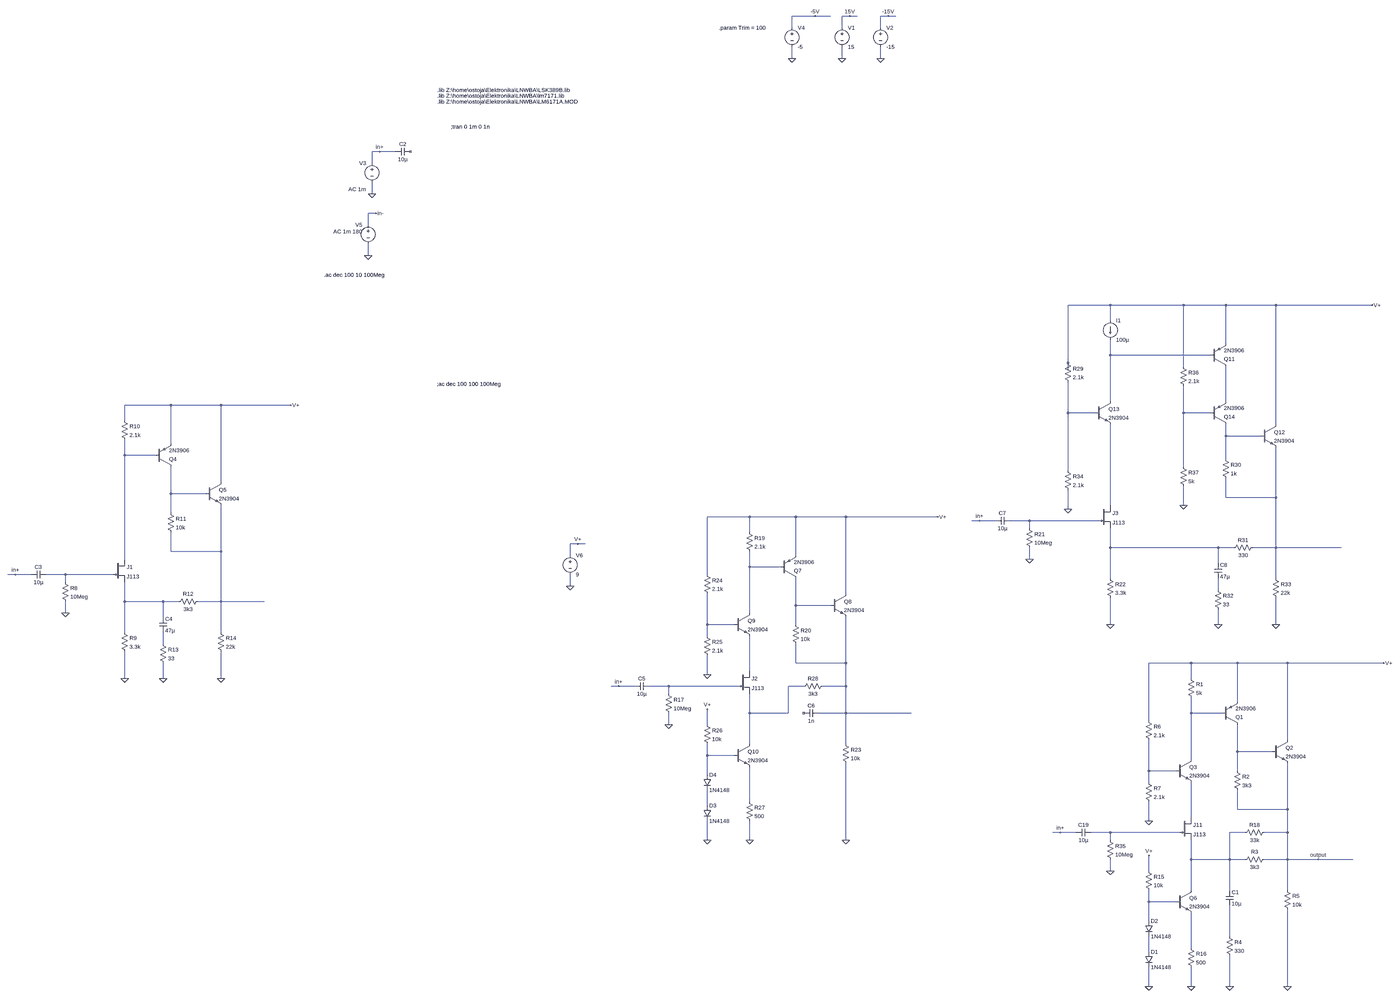
[diagram p0: schematic Figure_3.31.asc, whole sheet]
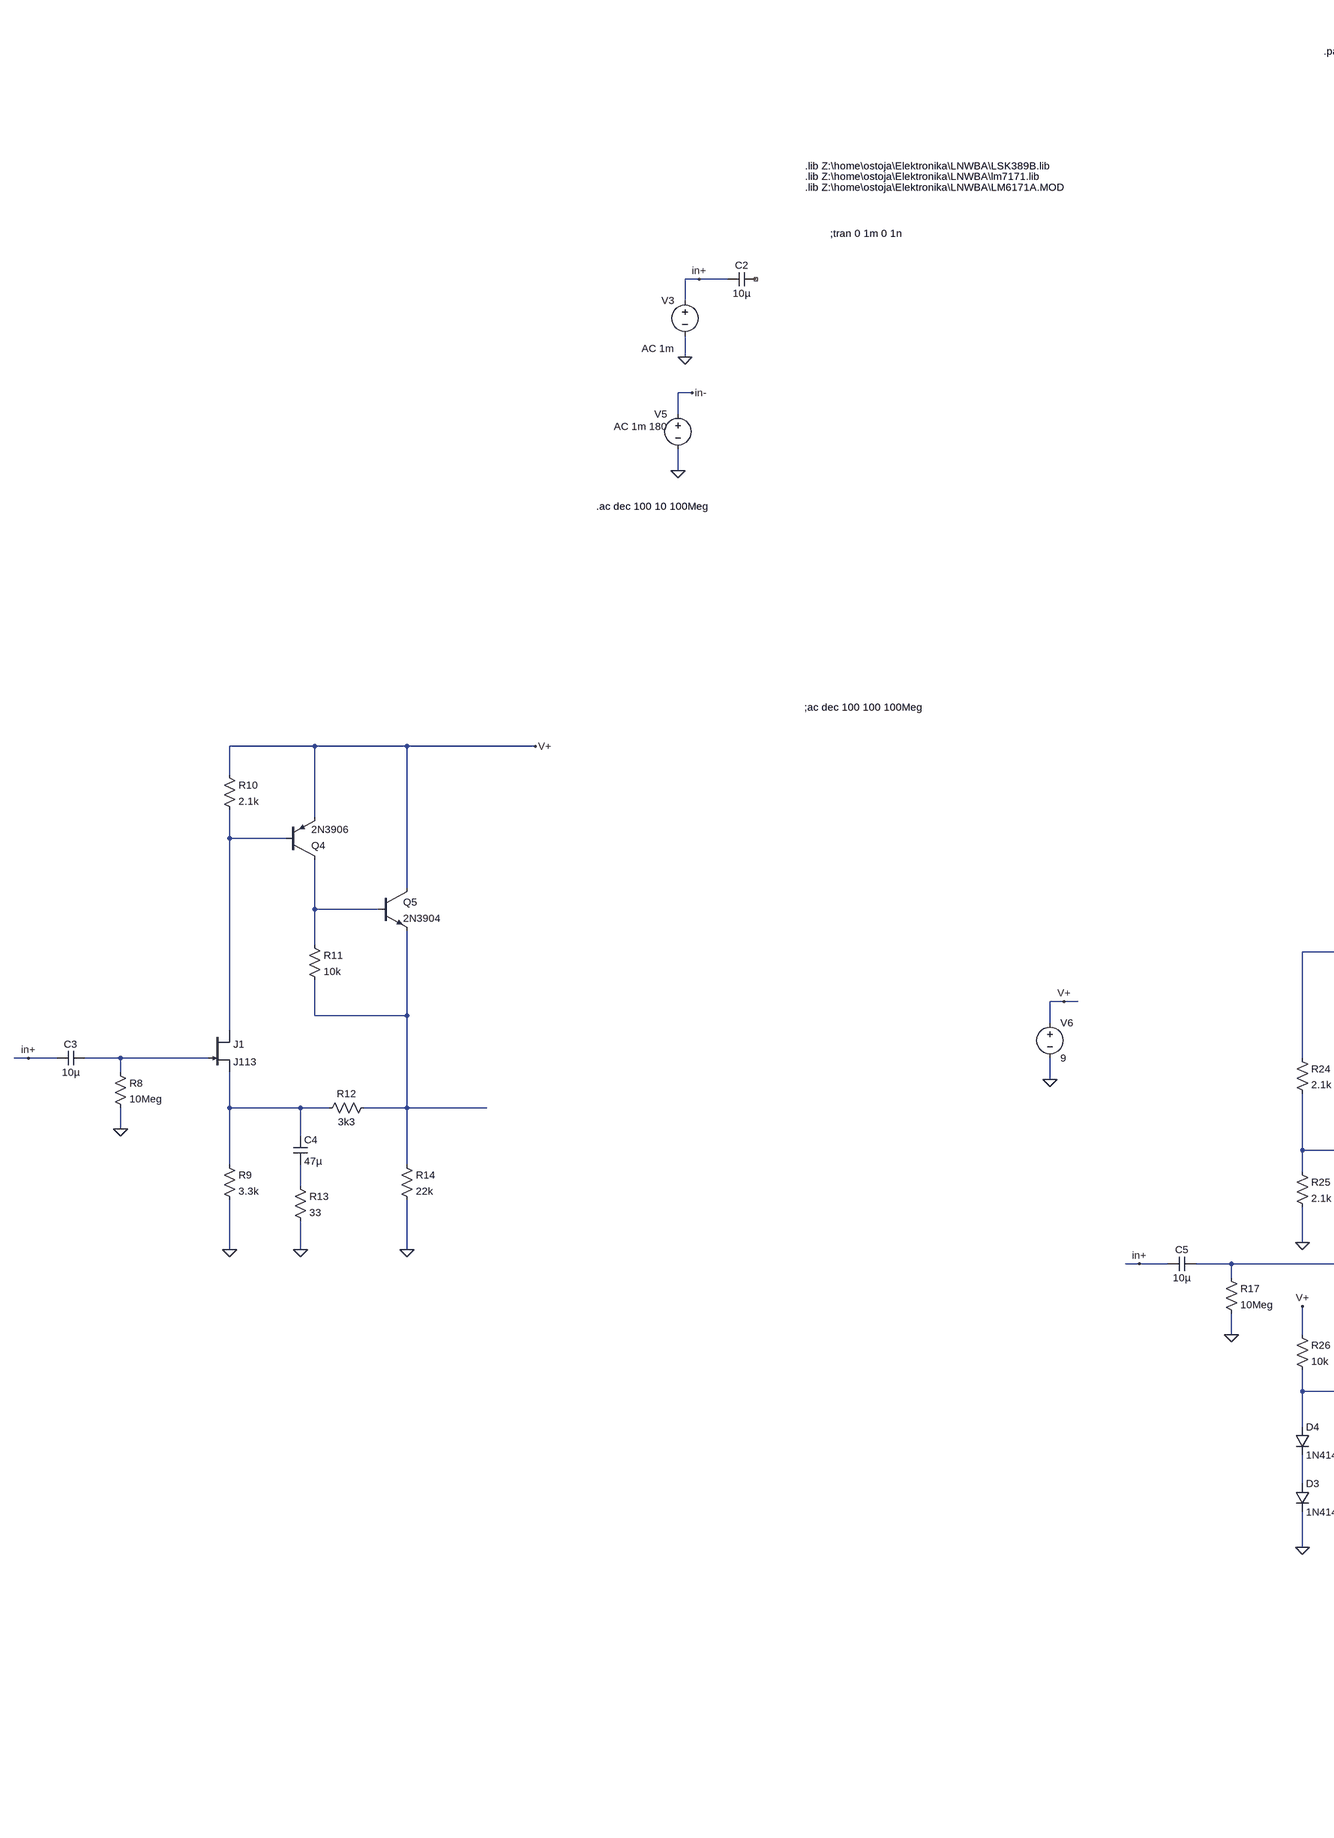
[diagram p1: schematic Figure_3.31.asc, part, row 1 of 1, column 1 of 2]
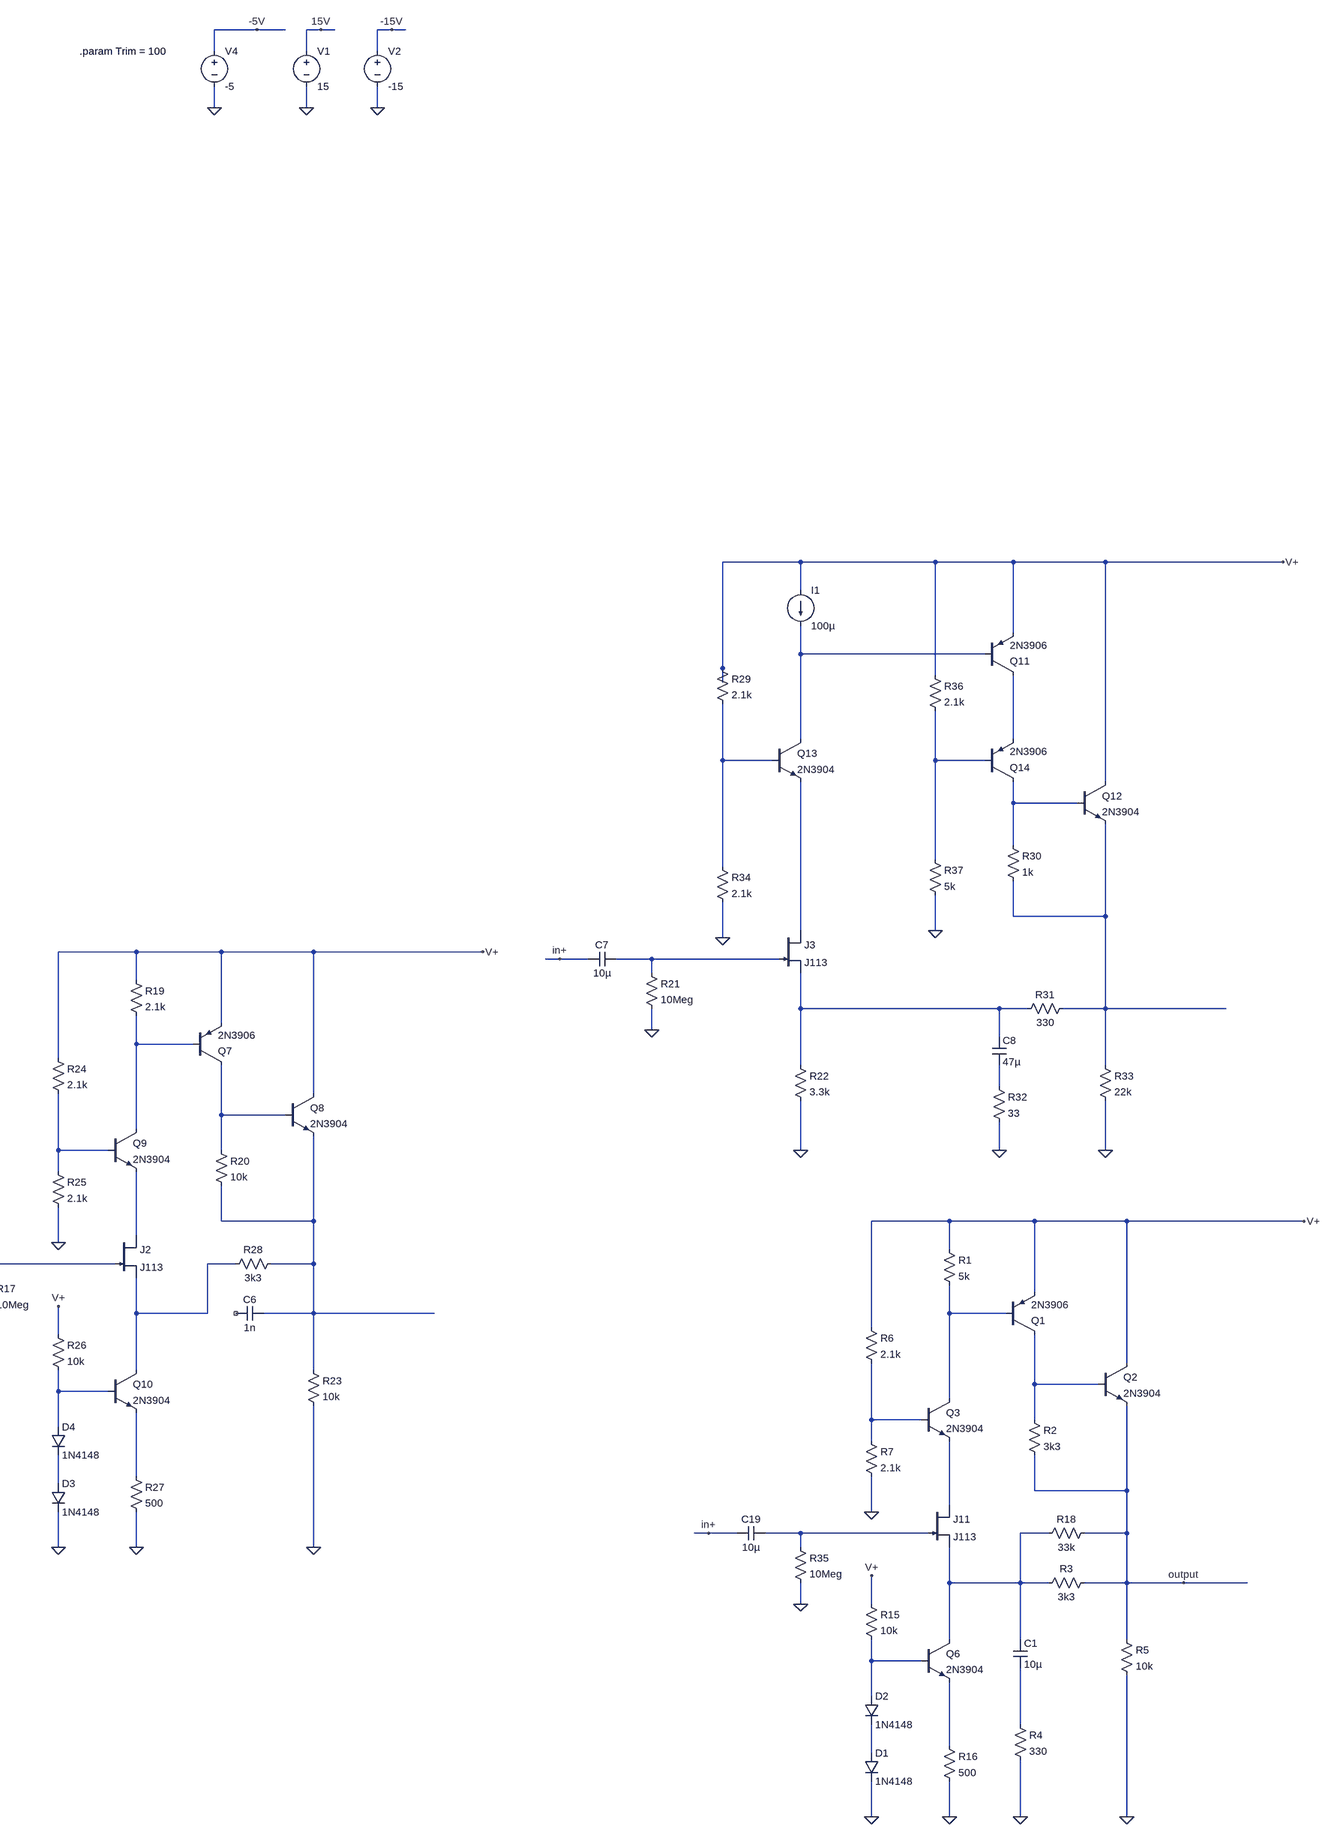
[diagram p2: schematic Figure_3.31.asc, part, row 1 of 1, column 2 of 2]
Figure_3.31.asc, the LTspice schematic file:
Version 4
SHEET 1 8100 6004
WIRE 960 -592 864 -592
WIRE 1024 -592 960 -592
WIRE 1104 -592 1072 -592
WIRE 1136 -592 1104 -592
WIRE 1264 -592 1232 -592
WIRE 1296 -592 1264 -592
WIRE 864 -544 864 -592
WIRE 1072 -544 1072 -592
WIRE 1232 -544 1232 -592
WIRE 864 -416 864 -464
WIRE 1072 -416 1072 -464
WIRE 1232 -416 1232 -464
WIRE -2000 32 -2032 32
WIRE -1936 32 -2000 32
WIRE -2032 80 -2032 32
WIRE -2032 208 -2032 160
WIRE -2016 288 -2048 288
WIRE -2048 336 -2048 288
WIRE -2048 464 -2048 416
WIRE 4720 912 4544 912
WIRE 5024 912 4720 912
WIRE 5200 912 5024 912
WIRE 5408 912 5200 912
WIRE 5808 912 5408 912
WIRE 4720 976 4720 912
WIRE 5200 1072 5200 912
WIRE 4720 1120 4720 1056
WIRE 5136 1120 4720 1120
WIRE 4544 1152 4544 912
WIRE 5024 1168 5024 912
WIRE 4544 1184 4544 1152
WIRE 4720 1312 4720 1120
WIRE 5200 1312 5200 1168
WIRE -3568 1328 -3760 1328
WIRE -3360 1328 -3568 1328
WIRE -2960 1328 -3360 1328
WIRE 4544 1360 4544 1232
WIRE 4656 1360 4544 1360
WIRE 5024 1360 5024 1248
WIRE 5136 1360 5024 1360
WIRE -3760 1392 -3760 1328
WIRE 5408 1408 5408 912
WIRE 5200 1456 5200 1408
WIRE 5344 1456 5200 1456
WIRE -3568 1488 -3568 1328
WIRE -3760 1536 -3760 1472
WIRE -3632 1536 -3760 1536
WIRE 5200 1552 5200 1456
WIRE 5024 1584 5024 1360
WIRE 4544 1600 4544 1360
WIRE -3360 1648 -3360 1328
WIRE -3568 1696 -3568 1584
WIRE -3424 1696 -3568 1696
WIRE 5200 1712 5200 1632
WIRE 5408 1712 5408 1504
WIRE 5408 1712 5200 1712
WIRE 4720 1744 4720 1408
WIRE 5024 1744 5024 1664
WIRE 4544 1760 4544 1680
WIRE -3568 1776 -3568 1696
WIRE 688 1792 512 1792
WIRE 880 1792 688 1792
WIRE 1088 1792 880 1792
WIRE 1488 1792 1088 1792
WIRE 4176 1808 4144 1808
WIRE 4240 1808 4176 1808
WIRE 4384 1808 4304 1808
WIRE 4672 1808 4384 1808
WIRE 4384 1840 4384 1808
WIRE 688 1856 688 1792
WIRE -608 1904 -640 1904
WIRE -576 1904 -608 1904
WIRE 4720 1920 4720 1840
WIRE 5168 1920 4720 1920
WIRE 5232 1920 5168 1920
WIRE 5408 1920 5408 1712
WIRE 5408 1920 5312 1920
WIRE 5680 1920 5408 1920
WIRE -3568 1936 -3568 1856
WIRE -3360 1936 -3360 1744
WIRE -3360 1936 -3568 1936
WIRE -640 1952 -640 1904
WIRE 880 1952 880 1792
WIRE -3760 1968 -3760 1536
WIRE 4384 1968 4384 1920
WIRE 5168 1984 5168 1920
WIRE 688 2000 688 1936
WIRE 816 2000 688 2000
WIRE -4304 2032 -4336 2032
WIRE -4240 2032 -4304 2032
WIRE -4096 2032 -4176 2032
WIRE -3808 2032 -4096 2032
WIRE 512 2032 512 1792
WIRE 4720 2048 4720 1920
WIRE 5408 2048 5408 1920
WIRE -4096 2064 -4096 2032
WIRE -640 2080 -640 2032
WIRE 5168 2096 5168 2048
WIRE 1088 2112 1088 1792
WIRE -3760 2144 -3760 2064
WIRE -3600 2144 -3760 2144
WIRE -3536 2144 -3600 2144
WIRE -3360 2144 -3360 1936
WIRE -3360 2144 -3456 2144
WIRE -3088 2144 -3360 2144
WIRE 880 2160 880 2048
WIRE 1024 2160 880 2160
WIRE -4096 2192 -4096 2144
WIRE 688 2192 688 2000
WIRE -3600 2208 -3600 2144
WIRE 512 2240 512 2112
WIRE 624 2240 512 2240
WIRE 880 2240 880 2160
WIRE 4720 2240 4720 2128
WIRE 5168 2240 5168 2176
WIRE 5408 2240 5408 2128
WIRE -3760 2272 -3760 2144
WIRE -3360 2272 -3360 2144
WIRE 512 2288 512 2240
WIRE -3600 2320 -3600 2272
WIRE 880 2400 880 2320
WIRE 1088 2400 1088 2208
WIRE 1088 2400 880 2400
WIRE 5056 2400 4880 2400
WIRE 5248 2400 5056 2400
WIRE 5456 2400 5248 2400
WIRE 5856 2400 5456 2400
WIRE 688 2432 688 2288
WIRE 512 2448 512 2368
WIRE -3760 2464 -3760 2352
WIRE -3600 2464 -3600 2400
WIRE -3360 2464 -3360 2352
WIRE 5056 2464 5056 2400
WIRE 144 2496 112 2496
WIRE 208 2496 144 2496
WIRE 352 2496 272 2496
WIRE 640 2496 352 2496
WIRE 912 2496 848 2496
WIRE 1088 2496 1088 2400
WIRE 1088 2496 992 2496
WIRE 352 2528 352 2496
WIRE 5248 2560 5248 2400
WIRE 688 2608 688 2528
WIRE 848 2608 848 2496
WIRE 848 2608 688 2608
WIRE 1088 2608 1088 2496
WIRE 1088 2608 976 2608
WIRE 1360 2608 1088 2608
WIRE 5056 2608 5056 2544
WIRE 5184 2608 5056 2608
WIRE 4880 2640 4880 2400
WIRE 352 2656 352 2608
WIRE 512 2656 512 2592
WIRE 5456 2720 5456 2400
WIRE 688 2736 688 2608
WIRE 1088 2736 1088 2608
WIRE 5248 2768 5248 2656
WIRE 5392 2768 5248 2768
WIRE 512 2784 512 2736
WIRE 624 2784 512 2784
WIRE 5056 2800 5056 2608
WIRE 4880 2848 4880 2720
WIRE 4992 2848 4880 2848
WIRE 5248 2848 5248 2768
WIRE 512 2864 512 2784
WIRE 4880 2896 4880 2848
WIRE 688 2976 688 2832
WIRE 512 2992 512 2928
WIRE 5248 3008 5248 2928
WIRE 5456 3008 5456 2816
WIRE 5456 3008 5248 3008
WIRE 5056 3040 5056 2896
WIRE 4880 3056 4880 2976
WIRE 4512 3104 4480 3104
WIRE 4576 3104 4512 3104
WIRE 4720 3104 4640 3104
WIRE 5008 3104 4720 3104
WIRE 5280 3104 5216 3104
WIRE 5456 3104 5456 3008
WIRE 5456 3104 5360 3104
WIRE 512 3136 512 3056
WIRE 688 3136 688 3056
WIRE 1088 3136 1088 2816
WIRE 4720 3136 4720 3104
WIRE 5056 3216 5056 3136
WIRE 5216 3216 5216 3104
WIRE 5216 3216 5056 3216
WIRE 5280 3216 5216 3216
WIRE 5456 3216 5456 3104
WIRE 5456 3216 5360 3216
WIRE 5584 3216 5456 3216
WIRE 5728 3216 5584 3216
WIRE 4720 3264 4720 3216
WIRE 4880 3264 4880 3200
WIRE 5056 3344 5056 3216
WIRE 5216 3344 5216 3216
WIRE 5456 3344 5456 3216
WIRE 4880 3392 4880 3344
WIRE 4992 3392 4880 3392
WIRE 4880 3472 4880 3392
WIRE 5216 3536 5216 3408
WIRE 5056 3584 5056 3440
WIRE 4880 3600 4880 3536
WIRE 4880 3744 4880 3664
WIRE 5056 3744 5056 3664
WIRE 5216 3744 5216 3616
WIRE 5456 3744 5456 3424
FLAG 1104 -592 15V
FLAG 1264 -592 -15V
FLAG 1232 -416 0
FLAG 1072 -416 0
FLAG 960 -592 -5V
FLAG 864 -416 0
FLAG 4512 3104 in+
FLAG 5856 2400 V+
FLAG 4720 3264 0
FLAG 5056 3744 0
FLAG 5216 3744 0
FLAG 5456 3744 0
FLAG -2032 208 0
FLAG -2000 32 in+
FLAG -2048 464 0
FLAG -2016 288 in-
FLAG -608 1904 V+
FLAG -640 2080 0
FLAG 4880 3056 0
FLAG 5584 3216 output
FLAG -4304 2032 in+
FLAG -2960 1328 V+
FLAG -4096 2192 0
FLAG -3760 2464 0
FLAG -3600 2464 0
FLAG -3360 2464 0
FLAG 4880 3744 0
FLAG 4880 3200 V+
FLAG 144 2496 in+
FLAG 1488 1792 V+
FLAG 352 2656 0
FLAG 688 3136 0
FLAG 1088 3136 0
FLAG 512 2448 0
FLAG 512 3136 0
FLAG 512 2592 V+
FLAG 4176 1808 in+
FLAG 5808 912 V+
FLAG 4384 1968 0
FLAG 4720 2240 0
FLAG 5168 2240 0
FLAG 5408 2240 0
FLAG 4544 1760 0
FLAG 5024 1744 0
SYMBOL voltage 1072 -560 R0
WINDOW 123 0 0 Left 0
WINDOW 39 0 0 Left 0
SYMATTR InstName V1
SYMATTR Value 15
SYMBOL voltage 1232 -560 R0
WINDOW 123 0 0 Left 0
WINDOW 39 0 0 Left 0
SYMATTR InstName V2
SYMATTR Value -15
SYMBOL voltage 864 -560 R0
WINDOW 123 0 0 Left 0
WINDOW 39 0 0 Left 0
SYMATTR InstName V4
SYMATTR Value -5
SYMBOL njf 5008 3040 R0
SYMATTR InstName J11
SYMATTR Value J113
SYMBOL cap 4640 3088 R90
WINDOW 0 0 32 VBottom 2
WINDOW 3 32 32 VTop 2
SYMATTR InstName C19
SYMATTR Value 10µ
SYMBOL res 4704 3120 R0
SYMATTR InstName R35
SYMATTR Value 10Meg
SYMBOL pnp 5184 2656 M180
SYMATTR InstName Q1
SYMATTR Value 2N3906
SYMBOL res 5040 2448 R0
SYMATTR InstName R1
SYMATTR Value 5k
SYMBOL res 5232 2832 R0
SYMATTR InstName R2
SYMATTR Value 3k3
SYMBOL npn 5392 2720 R0
SYMATTR InstName Q2
SYMATTR Value 2N3904
SYMBOL res 5376 3200 R90
WINDOW 0 0 56 VBottom 2
WINDOW 3 32 56 VTop 2
SYMATTR InstName R3
SYMATTR Value 3k3
SYMBOL cap 5200 3408 M180
WINDOW 0 24 56 Left 2
WINDOW 3 24 8 Left 2
SYMATTR InstName C1
SYMATTR Value 10µ
SYMBOL res 5200 3520 R0
SYMATTR InstName R4
SYMATTR Value 330
SYMBOL res 5440 3328 R0
SYMATTR InstName R5
SYMATTR Value 10k
SYMBOL voltage -2032 64 M0
WINDOW 123 24 124 Left 2
WINDOW 39 0 0 Left 0
SYMATTR Value2 AC 1m
SYMATTR InstName V3
SYMATTR Value ""
SYMBOL cap -1872 16 R90
WINDOW 0 0 32 VBottom 2
WINDOW 3 32 32 VTop 2
SYMATTR InstName C2
SYMATTR Value 10µ
SYMBOL voltage -2048 320 M0
WINDOW 123 24 44 Left 2
WINDOW 39 0 0 Left 0
SYMATTR Value2 AC 1m 180
SYMATTR InstName V5
SYMATTR Value ""
SYMBOL voltage -640 1936 R0
WINDOW 123 0 0 Left 0
WINDOW 39 0 0 Left 0
SYMATTR InstName V6
SYMATTR Value 9
SYMBOL npn 4992 2800 R0
SYMATTR InstName Q3
SYMATTR Value 2N3904
SYMBOL res 4864 2624 R0
SYMATTR InstName R6
SYMATTR Value 2.1k
SYMBOL res 4864 2880 R0
SYMATTR InstName R7
SYMATTR Value 2.1k
SYMBOL njf -3808 1968 R0
SYMATTR InstName J1
SYMATTR Value J113
SYMBOL cap -4176 2016 R90
WINDOW 0 0 32 VBottom 2
WINDOW 3 32 32 VTop 2
SYMATTR InstName C3
SYMATTR Value 10µ
SYMBOL res -4112 2048 R0
SYMATTR InstName R8
SYMATTR Value 10Meg
SYMBOL res -3776 2256 R0
SYMATTR InstName R9
SYMATTR Value 3.3k
SYMBOL pnp -3632 1584 M180
SYMATTR InstName Q4
SYMATTR Value 2N3906
SYMBOL res -3776 1376 R0
SYMATTR InstName R10
SYMATTR Value 2.1k
SYMBOL res -3584 1760 R0
SYMATTR InstName R11
SYMATTR Value 10k
SYMBOL npn -3424 1648 R0
SYMATTR InstName Q5
SYMATTR Value 2N3904
SYMBOL res -3440 2128 R90
WINDOW 0 0 56 VBottom 2
WINDOW 3 32 56 VTop 2
SYMATTR InstName R12
SYMATTR Value 3k3
SYMBOL cap -3616 2272 M180
WINDOW 0 24 56 Left 2
WINDOW 3 24 8 Left 2
SYMATTR InstName C4
SYMATTR Value 47µ
SYMBOL res -3616 2304 R0
SYMATTR InstName R13
SYMATTR Value 33
SYMBOL res -3376 2256 R0
SYMATTR InstName R14
SYMATTR Value 22k
SYMBOL npn 4992 3344 R0
SYMATTR InstName Q6
SYMATTR Value 2N3904
SYMBOL diode 4864 3600 R0
SYMATTR InstName D1
SYMATTR Value 1N4148
SYMBOL diode 4864 3472 R0
SYMATTR InstName D2
SYMATTR Value 1N4148
SYMBOL res 4864 3248 R0
SYMATTR InstName R15
SYMATTR Value 10k
SYMBOL res 5040 3568 R0
SYMATTR InstName R16
SYMATTR Value 500
SYMBOL res 5376 3088 R90
WINDOW 0 0 56 VBottom 2
WINDOW 3 32 56 VTop 2
SYMATTR InstName R18
SYMATTR Value 33k
SYMBOL njf 640 2432 R0
SYMATTR InstName J2
SYMATTR Value J113
SYMBOL cap 272 2480 R90
WINDOW 0 0 32 VBottom 2
WINDOW 3 32 32 VTop 2
SYMATTR InstName C5
SYMATTR Value 10µ
SYMBOL res 336 2512 R0
SYMATTR InstName R17
SYMATTR Value 10Meg
SYMBOL pnp 816 2048 M180
SYMATTR InstName Q7
SYMATTR Value 2N3906
SYMBOL res 672 1840 R0
SYMATTR InstName R19
SYMATTR Value 2.1k
SYMBOL res 864 2224 R0
SYMATTR InstName R20
SYMATTR Value 10k
SYMBOL npn 1024 2112 R0
SYMATTR InstName Q8
SYMATTR Value 2N3904
SYMBOL res 1072 2720 R0
SYMATTR InstName R23
SYMATTR Value 10k
SYMBOL npn 624 2192 R0
SYMATTR InstName Q9
SYMATTR Value 2N3904
SYMBOL res 496 2016 R0
SYMATTR InstName R24
SYMATTR Value 2.1k
SYMBOL res 496 2272 R0
SYMATTR InstName R25
SYMATTR Value 2.1k
SYMBOL npn 624 2736 R0
SYMATTR InstName Q10
SYMATTR Value 2N3904
SYMBOL diode 496 2992 R0
SYMATTR InstName D3
SYMATTR Value 1N4148
SYMBOL diode 496 2864 R0
SYMATTR InstName D4
SYMATTR Value 1N4148
SYMBOL res 496 2640 R0
SYMATTR InstName R26
SYMATTR Value 10k
SYMBOL res 672 2960 R0
SYMATTR InstName R27
SYMATTR Value 500
SYMBOL res 1008 2480 R90
WINDOW 0 0 56 VBottom 2
WINDOW 3 32 56 VTop 2
SYMATTR InstName R28
SYMATTR Value 3k3
SYMBOL cap 976 2592 R90
WINDOW 0 0 32 VBottom 2
WINDOW 3 32 32 VTop 2
SYMATTR InstName C6
SYMATTR Value 1n
SYMBOL njf 4672 1744 R0
SYMATTR InstName J3
SYMATTR Value J113
SYMBOL cap 4304 1792 R90
WINDOW 0 0 32 VBottom 2
WINDOW 3 32 32 VTop 2
SYMATTR InstName C7
SYMATTR Value 10µ
SYMBOL res 4368 1824 R0
SYMATTR InstName R21
SYMATTR Value 10Meg
SYMBOL res 4704 2032 R0
SYMATTR InstName R22
SYMATTR Value 3.3k
SYMBOL pnp 5136 1168 M180
SYMATTR InstName Q11
SYMATTR Value 2N3906
SYMBOL res 5184 1536 R0
SYMATTR InstName R30
SYMATTR Value 1k
SYMBOL npn 5344 1408 R0
SYMATTR InstName Q12
SYMATTR Value 2N3904
SYMBOL res 5328 1904 R90
WINDOW 0 0 56 VBottom 2
WINDOW 3 32 56 VTop 2
SYMATTR InstName R31
SYMATTR Value 330
SYMBOL cap 5152 2048 M180
WINDOW 0 24 56 Left 2
WINDOW 3 24 8 Left 2
SYMATTR InstName C8
SYMATTR Value 47µ
SYMBOL res 5152 2080 R0
SYMATTR InstName R32
SYMATTR Value 33
SYMBOL res 5392 2032 R0
SYMATTR InstName R33
SYMATTR Value 22k
SYMBOL current 4720 976 R0
WINDOW 123 0 0 Left 0
WINDOW 39 0 0 Left 0
SYMATTR InstName I1
SYMATTR Value 100µ
SYMBOL npn 4656 1312 R0
SYMATTR InstName Q13
SYMATTR Value 2N3904
SYMBOL res 4528 1136 R0
SYMATTR InstName R29
SYMATTR Value 2.1k
SYMBOL res 4528 1584 R0
SYMATTR InstName R34
SYMATTR Value 2.1k
SYMBOL res 5008 1152 R0
SYMATTR InstName R36
SYMATTR Value 2.1k
SYMBOL res 5008 1568 R0
SYMATTR InstName R37
SYMATTR Value 5k
SYMBOL pnp 5136 1408 M180
SYMATTR InstName Q14
SYMATTR Value 2N3906
TEXT -1192 -224 Left 2 !.lib Z:\\home\\ostoja\\Elektronika\\LNWBA\\LSK389B.lib
TEXT -1136 -72 Left 2 !;tran 0 1m 0 1n
TEXT -1192 -200 Left 2 !.lib Z:\\home\\ostoja\\Elektronika\\LNWBA\\lm7171.lib
TEXT -1192 -176 Left 2 !.lib Z:\\home\\ostoja\\Elektronika\\LNWBA\\LM6171A.MOD
TEXT 560 -544 Left 2 !.param Trim = 100
TEXT -1194 1240 Left 2 !;ac dec 100 100 100Meg
TEXT -2232 544 Left 2 !.ac dec 100 10 100Meg

The netlist it stands for:
* Figure_3.31.asc
V1 15V 0 15
V2 -15V 0 -15
V4 -5V 0 -5
J11 N030 N031 N032 J113
C19 N031 in+ 10µ
R35 N031 0 10Meg
Q1 N025 N024 V+ 0 2N3906
R1 V+ N024 5k
R2 N025 output 3k3
Q2 V+ N025 output 0 2N3904
R3 output N032 3k3
C1 N034 N032 10µ
R4 N034 0 330
R5 output 0 10k
V3 in+ 0 AC 1m
C2 NC_01 in+ 10µ
V5 in- 0 AC 1m 180
V6 V+ 0 9
Q3 N024 N027 N030 0 2N3904
R6 V+ N027 2.1k
R7 N027 0 2.1k
J1 N006 N014 N016 J113
C3 N014 in+ 10µ
R8 N014 0 10Meg
R9 N016 0 3.3k
Q4 N007 N006 V+ 0 2N3906
R10 V+ N006 2.1k
R11 N007 N012 10k
Q5 V+ N007 N012 0 2N3904
R12 N012 N016 3k3
C4 N019 N016 47µ
R13 N019 0 33
R14 N012 0 22k
Q6 N032 N033 N035 0 2N3904
D1 N036 0 1N4148
D2 N033 N036 1N4148
R15 V+ N033 10k
R16 N035 0 500
R18 output N032 33k
J2 N021 N022 N023 J113
C5 N022 in+ 10µ
R17 N022 0 10Meg
Q7 N017 N013 V+ 0 2N3906
R19 V+ N013 2.1k
R20 N017 N020 10k
Q8 V+ N017 N020 0 2N3904
R23 N020 0 10k
Q9 N013 N018 N021 0 2N3904
R24 V+ N018 2.1k
R25 N018 0 2.1k
Q10 N023 N026 N028 0 2N3904
D3 N029 0 1N4148
D4 N026 N029 1N4148
R26 V+ N026 10k
R27 N028 0 500
R28 N020 N023 3k3
C6 N020 NC_02 1n
J3 N009 N010 N011 J113
C7 N010 in+ 10µ
R21 N010 0 10Meg
R22 N011 0 3.3k
Q11 N002 N001 V+ 0 2N3906
R30 N005 N008 1k
Q12 V+ N005 N008 0 2N3904
R31 N008 N011 330
C8 N015 N011 47µ
R32 N015 0 33
R33 N008 0 22k
I1 V+ N001 100µ
Q13 N001 N003 N009 0 2N3904
R29 V+ N003 2.1k
R34 N003 0 2.1k
R36 V+ N004 2.1k
R37 N004 0 5k
Q14 N005 N004 N002 0 2N3906
.model D D
.lib standard.dio
.model NPN NPN
.model PNP PNP
.lib standard.bjt
.model NJF NJF
.model PJF PJF
.lib standard.jft
.lib Z:\home\ostoja\Elektronika\LNWBA\LSK389B.lib
;tran 0 1m 0 1n
.lib Z:\home\ostoja\Elektronika\LNWBA\lm7171.lib
.lib Z:\home\ostoja\Elektronika\LNWBA\LM6171A.MOD
.param Trim = 100
;ac dec 100 100 100Meg
.ac dec 100 10 100Meg
.backanno
.end